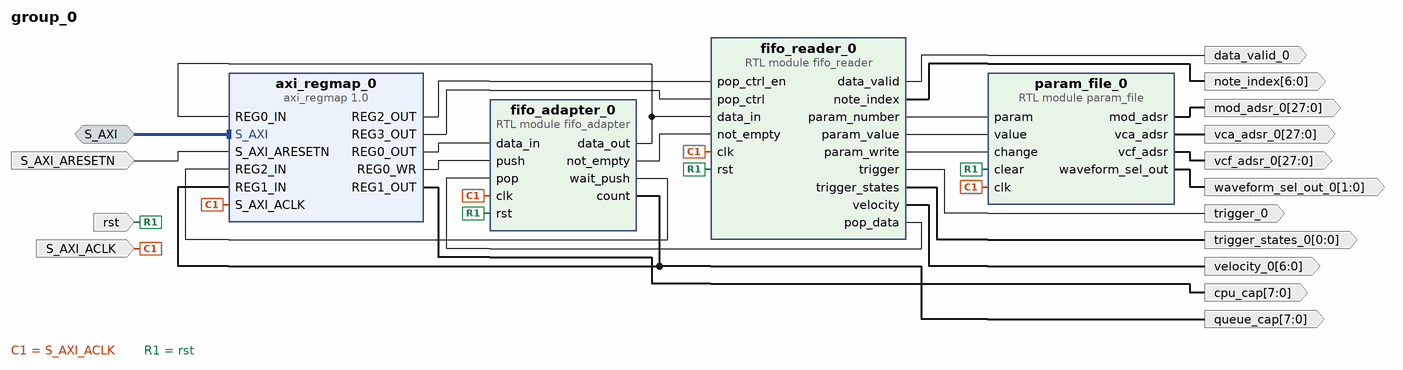
[diagram p0: block diagram of the top level]
# Vivado block design group_0, xc7z020clg400-1, Vivado 2021.1
create_bd_design group_0

create_bd_intf_port -mode Slave -vlnv xilinx.com:interface:aximm_rtl:1.0 S_AXI
set_property -dict [list \
  CONFIG.ADDR_WIDTH 31 \
  CONFIG.ARUSER_WIDTH 0 \
  CONFIG.AWUSER_WIDTH 0 \
  CONFIG.BUSER_WIDTH 0 \
  CONFIG.DATA_WIDTH 32 \
  CONFIG.HAS_BRESP 1 \
  CONFIG.HAS_BURST 0 \
  CONFIG.HAS_CACHE 0 \
  CONFIG.HAS_LOCK 0 \
  CONFIG.HAS_PROT 1 \
  CONFIG.HAS_QOS 0 \
  CONFIG.HAS_REGION 0 \
  CONFIG.HAS_RRESP 1 \
  CONFIG.HAS_WSTRB 1 \
  CONFIG.ID_WIDTH 0 \
  CONFIG.MAX_BURST_LENGTH 1 \
  CONFIG.NUM_READ_OUTSTANDING 1 \
  CONFIG.NUM_READ_THREADS 4 \
  CONFIG.NUM_WRITE_OUTSTANDING 1 \
  CONFIG.NUM_WRITE_THREADS 4 \
  CONFIG.PROTOCOL AXI4LITE \
  CONFIG.READ_WRITE_MODE READ_WRITE \
  CONFIG.RUSER_BITS_PER_BYTE 0 \
  CONFIG.RUSER_WIDTH 0 \
  CONFIG.SUPPORTS_NARROW_BURST 0 \
  CONFIG.WUSER_BITS_PER_BYTE 0 \
  CONFIG.WUSER_WIDTH 0 \
] [get_bd_intf_ports S_AXI]
create_bd_port -dir I -type clk S_AXI_ACLK
set_property -dict {CONFIG.ASSOCIATED_BUSIF S_AXI CONFIG.ASSOCIATED_RESET rst:S_AXI_ARESETN} [get_bd_ports S_AXI_ACLK]
create_bd_port -dir I -type rst S_AXI_ARESETN
create_bd_port -dir O -from 7 -to 0 queue_cap
create_bd_port -dir O data_valid_0
create_bd_port -dir I -type rst rst
set_property -dict {CONFIG.POLARITY ACTIVE_HIGH} [get_bd_ports rst]
create_bd_port -dir O trigger_0
create_bd_port -dir O -from 6 -to 0 velocity_0
create_bd_port -dir O -from 6 -to 0 note_index
create_bd_port -dir O -from 0 -to 0 trigger_states_0
create_bd_port -dir O -from 7 -to 0 cpu_cap
create_bd_port -dir O -from 27 -to 0 mod_adsr_0
create_bd_port -dir O -from 27 -to 0 vca_adsr_0
create_bd_port -dir O -from 27 -to 0 vcf_adsr_0
create_bd_port -dir O -from 1 -to 0 waveform_sel_out_0

create_bd_cell -type ip -vlnv SHREC:SHREC:axi_regmap:1.0 axi_regmap_0
set_property -dict [list \
  CONFIG.NUM_REGS 4 \
  CONFIG.WIDTH0 16 \
  CONFIG.WIDTH1 8 \
  CONFIG.WIDTH2 1 \
  CONFIG.WIDTH3 1 \
] [get_bd_cells axi_regmap_0]
create_bd_cell -type module -reference fifo_adapter fifo_adapter_0
set_property -dict {CONFIG.DATA_WIDTH 16} [get_bd_cells fifo_adapter_0]
create_bd_cell -type module -reference fifo_reader fifo_reader_0
set_property -dict {CONFIG.DATA_WIDTH 16} [get_bd_cells fifo_reader_0]
create_bd_cell -type module -reference param_file param_file_0

# ---- connections ----

connect_bd_intf_net [get_bd_intf_ports S_AXI] [get_bd_intf_pins axi_regmap_0/S_AXI]
connect_bd_net [get_bd_pins axi_regmap_0/REG0_OUT] [get_bd_pins fifo_adapter_0/data_in]
connect_bd_net [get_bd_pins axi_regmap_0/REG0_WR] [get_bd_pins fifo_adapter_0/push]
connect_bd_net [get_bd_pins axi_regmap_0/REG1_OUT] [get_bd_ports cpu_cap]
connect_bd_net [get_bd_pins axi_regmap_0/REG2_OUT] [get_bd_pins fifo_reader_0/pop_ctrl_en]
connect_bd_net [get_bd_pins axi_regmap_0/REG3_OUT] [get_bd_pins fifo_reader_0/pop_ctrl]
connect_bd_net [get_bd_pins fifo_adapter_0/count] [get_bd_ports queue_cap] [get_bd_pins axi_regmap_0/REG1_IN]
connect_bd_net [get_bd_pins fifo_adapter_0/data_out] [get_bd_pins axi_regmap_0/REG0_IN] [get_bd_pins fifo_reader_0/data_in]
connect_bd_net [get_bd_pins fifo_adapter_0/not_empty] [get_bd_pins fifo_reader_0/not_empty]
connect_bd_net [get_bd_pins fifo_adapter_0/wait_push] [get_bd_pins axi_regmap_0/REG2_IN]
connect_bd_net [get_bd_pins fifo_reader_0/data_valid] [get_bd_ports data_valid_0]
connect_bd_net -net fifo_reader_0_note [get_bd_pins fifo_reader_0/note_index] [get_bd_ports note_index]
connect_bd_net [get_bd_pins fifo_reader_0/param_number] [get_bd_pins param_file_0/param]
connect_bd_net [get_bd_pins fifo_reader_0/param_value] [get_bd_pins param_file_0/value]
connect_bd_net [get_bd_pins fifo_reader_0/param_write] [get_bd_pins param_file_0/change]
connect_bd_net [get_bd_pins fifo_reader_0/pop_data] [get_bd_pins fifo_adapter_0/pop]
connect_bd_net [get_bd_pins fifo_reader_0/trigger] [get_bd_ports trigger_0]
connect_bd_net [get_bd_pins fifo_reader_0/trigger_states] [get_bd_ports trigger_states_0]
connect_bd_net [get_bd_pins fifo_reader_0/velocity] [get_bd_ports velocity_0]
connect_bd_net [get_bd_pins param_file_0/mod_adsr] [get_bd_ports mod_adsr_0]
connect_bd_net [get_bd_pins param_file_0/vca_adsr] [get_bd_ports vca_adsr_0]
connect_bd_net [get_bd_pins param_file_0/vcf_adsr] [get_bd_ports vcf_adsr_0]
connect_bd_net [get_bd_pins param_file_0/waveform_sel_out] [get_bd_ports waveform_sel_out_0]
connect_bd_net -net processing_system7_0_FCLK_CLK0 [get_bd_ports S_AXI_ACLK] \
  [get_bd_pins axi_regmap_0/S_AXI_ACLK] [get_bd_pins fifo_adapter_0/clk] [get_bd_pins fifo_reader_0/clk] \
  [get_bd_pins param_file_0/clk]
connect_bd_net -net rst_ps7_0_100M_peripheral_aresetn [get_bd_ports S_AXI_ARESETN] [get_bd_pins axi_regmap_0/S_AXI_ARESETN]
connect_bd_net -net rst_ps7_0_100M_peripheral_reset [get_bd_ports rst] \
  [get_bd_pins fifo_adapter_0/rst] [get_bd_pins fifo_reader_0/rst] [get_bd_pins param_file_0/clear]

# ---- address map ----
assign_bd_address -offset 0x43C00000 -range 64K -target_address_space [get_bd_addr_spaces S_AXI] [get_bd_addr_segs axi_regmap_0/S_AXI/reg0]

validate_bd_design
save_bd_design
